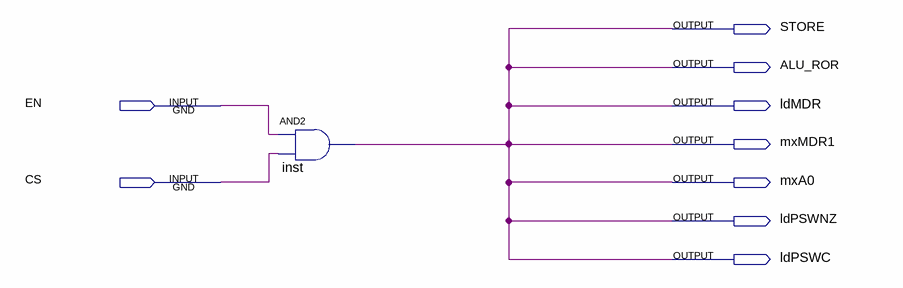
[diagram p0: schematic sheet]
// Quartus schematic ROR.bdf as structural Verilog: 1 symbols, 9 pins
module ROR (
  input  EN,
  input  CS,
  output STORE,
  output ALU_ROR,
  output ldMDR,
  output mxMDR1,
  output mxA0,
  output ldPSWNZ,
  output ldPSWC
);

  and inst (ALU_ROR, EN, CS);

  assign ldMDR = ALU_ROR;
  assign ldPSWC = ALU_ROR;
  assign ldPSWNZ = ALU_ROR;
  assign mxA0 = ALU_ROR;
  assign mxMDR1 = ALU_ROR;
  assign STORE = ALU_ROR;
endmodule
